# Altium schematic sheet Analog Front End.SchDoc: Analog Front End
size A4; SheetNumber: 5; SheetTotal: 6
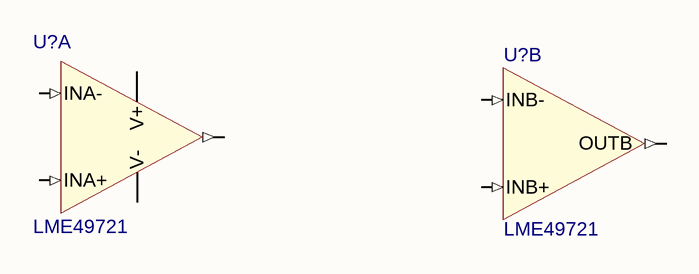
[diagram p0: Analog Front End.SchDoc]

## Parts
(Parts that share a designator on the sheet are numbered #1, #2 ... from top to bottom, then left to right.)
U?#1  LME49721  [SOIC-8N - LME49721]  (part A of 2)
U?#2  LME49721  [SOIC-8N - LME49721]  (part B of 2)

## Nets

Not connected (* = marked no-connect by the designer): U?#1 1(OUTA) 2(INA-) 3(INA+) 4(V-) 8(V+); U?#2 5(INB+) 6(INB-) 7(OUTB)

## Notes on the sheet
- TITLE
- DRAWN BY
- DATE
- PROJECT
- FILE
- SHEET SIZE
- A4
- REVISION
- PAGE
- of

## Library data of the parts
U?#1 U?#2 = LME49721: Audio Amplifier 2 Circuit Rail-to-Rail 8-SOIC; Supplier 1: Digi-Key; Supplier 2: Mouser; Supplier Part Number 3: C129347; Supplier Part Number 2: 926-LME49721MAX/NOPB; Supplier Part Number 1: 296-41312-1-ND; Supplier 3: LCSC